# EasyEDA schematic 1-Schematic_SAE301.json
TITLE: Sheet_1; REV: 1.0; Date: 2023-10-09; Sheet: 1/1; Drawn By: og67guittet; Company: Your Company
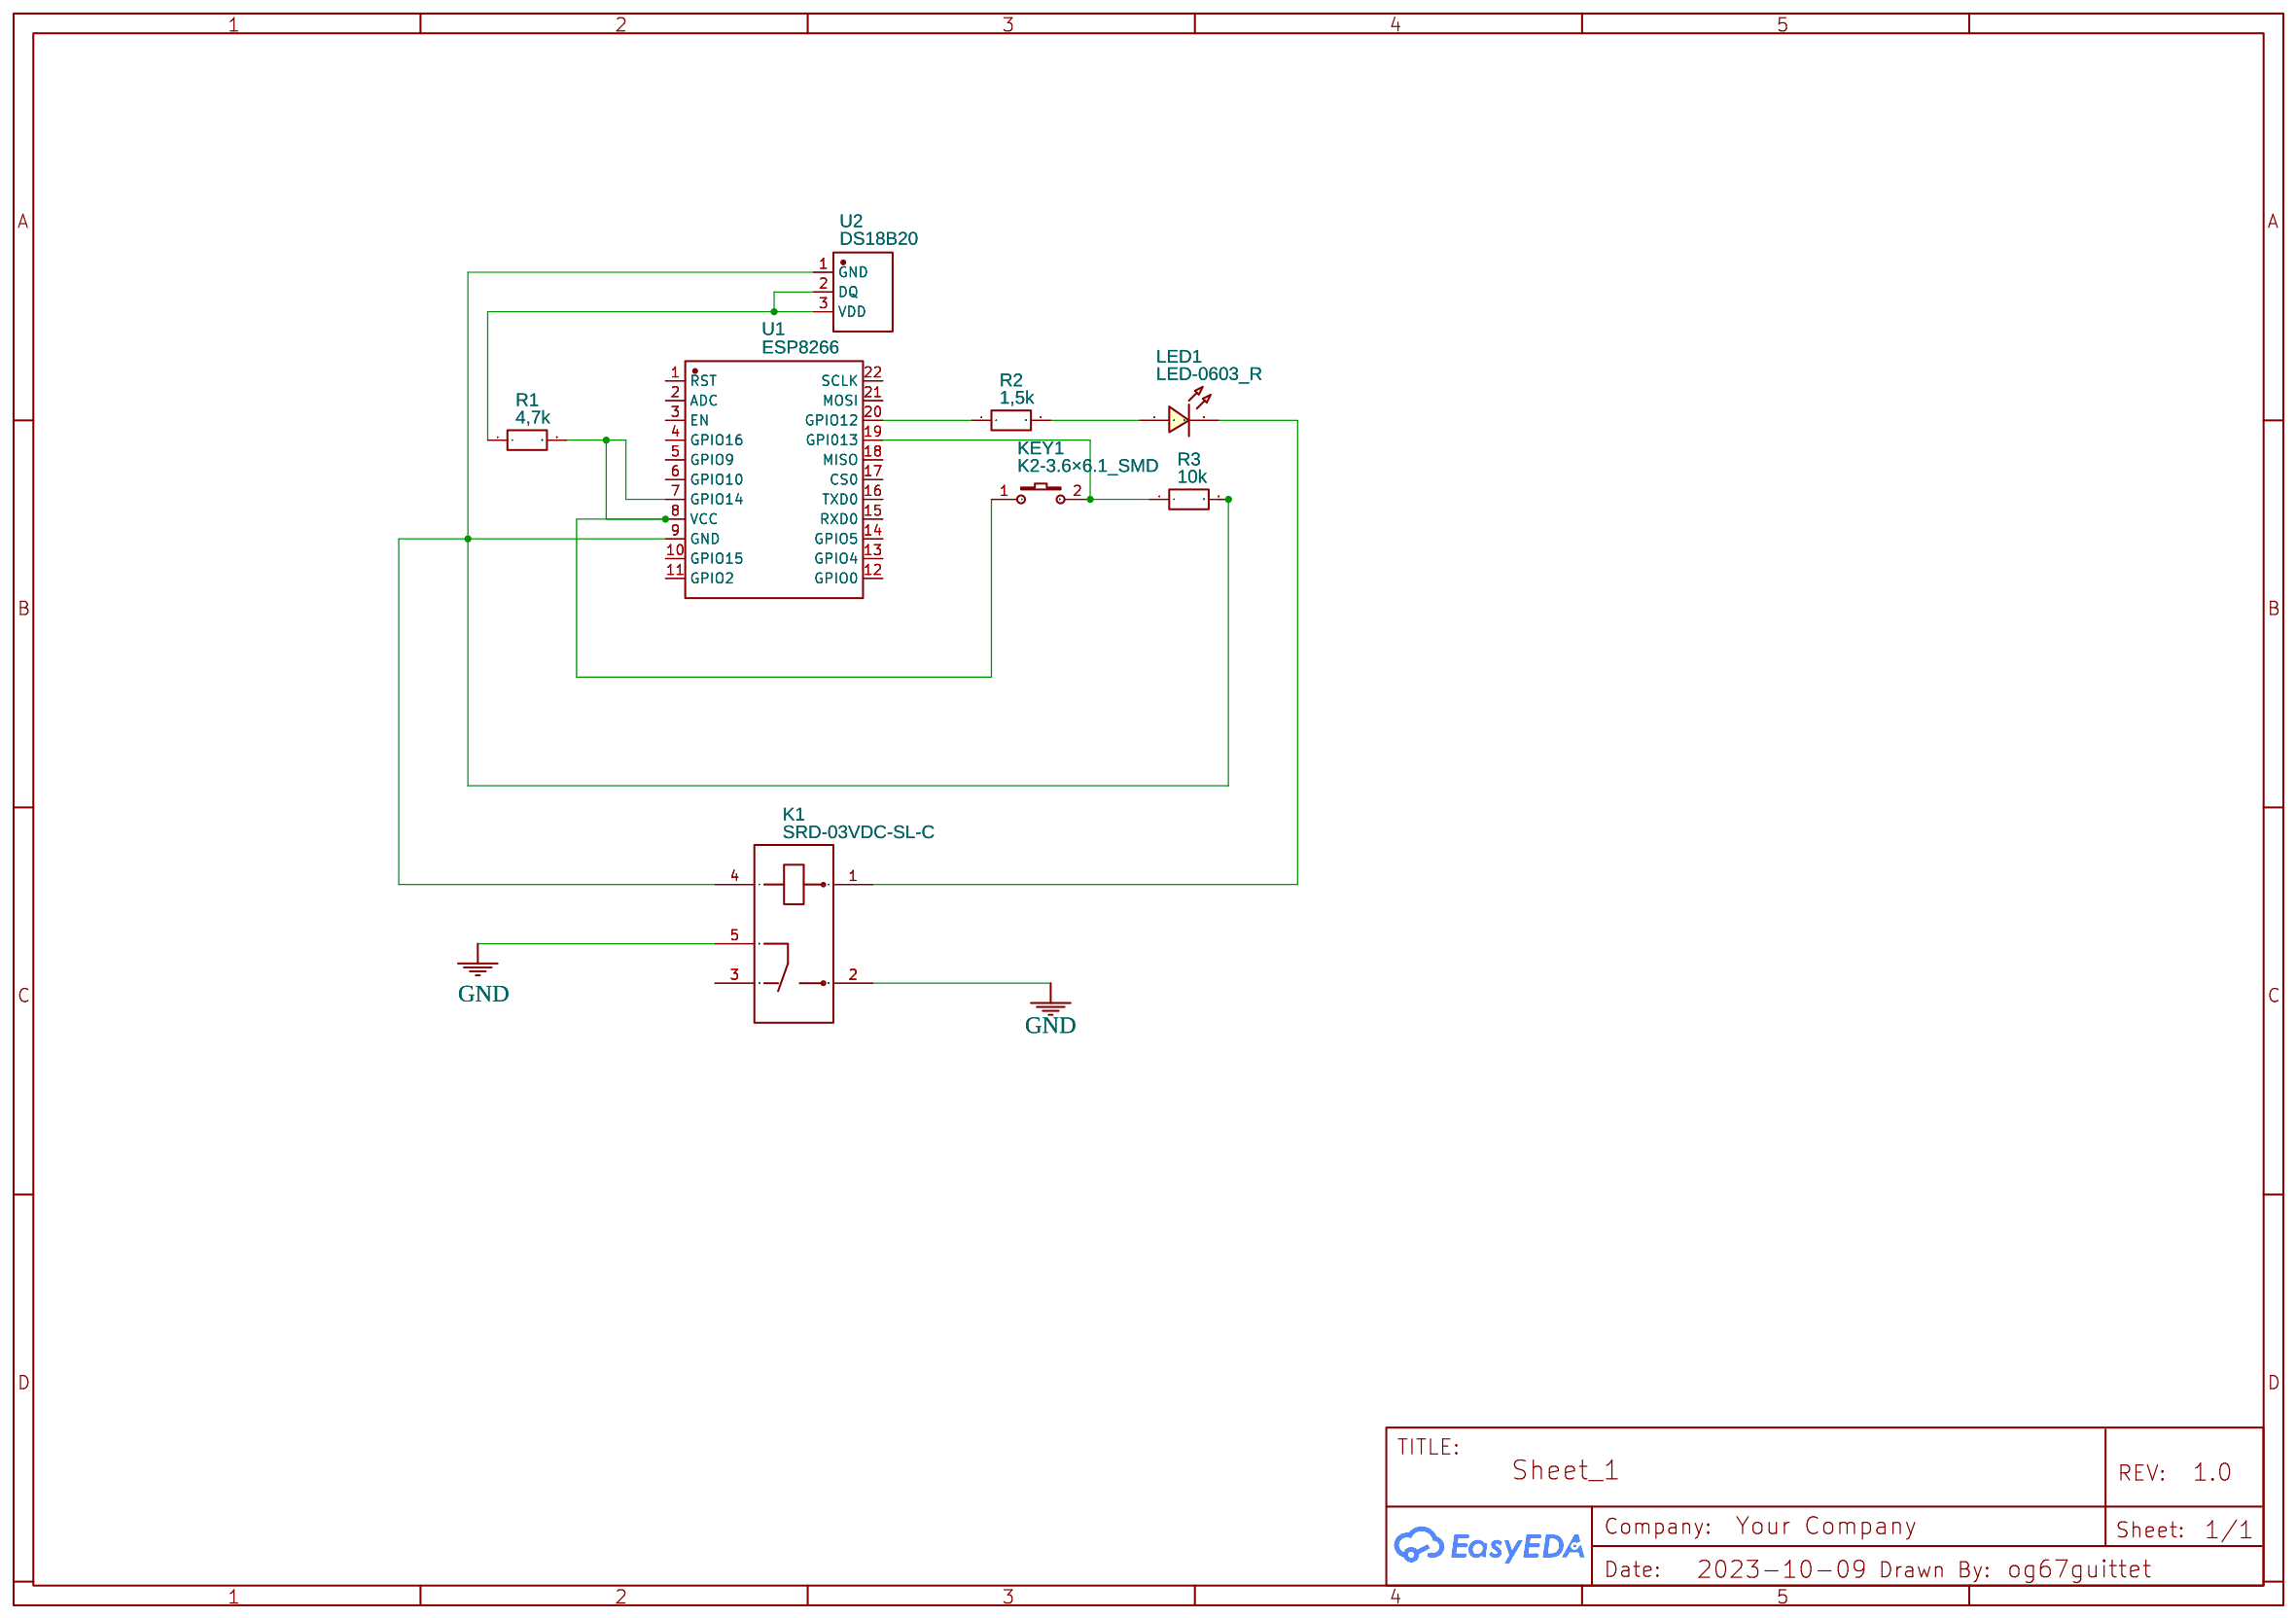
[diagram p0: schematic sheet]

## Parts
K1  SRD-03VDC-SL-C  [RELAY-TH_SRD-XXVDC-XL-C]
KEY1  K2-3.6×6.1_SMD  [KEY-SMD_2P-L6.2-W3.6-LS8.0]
LED1  LED-0603_R  [LED0603_RED]
R1  4,7k  [R0603]
R2  1,5k  [R0603]
R3  10k  [R0603]
U1  ESP8266  [WIFIM-SMD_ESP-12F-ESP8266MOD]
U2  DS18B20  [TO-92-3_L4.9-W3.7-P1.27-L]

## Library data of the parts
K1 = SRD-03VDC-SL-C: Supplier: LCSC; Manufacturer: 松乐; Supplier Part: C24585; JLCPCB Part Class: Extended Part; link: https://lcsc.com/eda_search?q=C24585&%26type=1&ref=editor
KEY1 = K2-3.6×6.1_SMD: Supplier Part: C118141; Supplier: LCSC; Manufacturer Part: K2-1107ST-A4SW-06; Contributor: LCEDA_Lib; 制造商: 韩国韩荣
LED1 = LED-0603_R: Manufacturer: EVERLIGHT(台湾亿光); Manufacturer Part: 19-217/R6C-AL1M2VY/3T; Supplier Part: C72044; Supplier: LCSC; Contributor: LCEDA_01
R1-R3 = R_0603_EU: Contributor: LCEDA_Lib
U1 = ESP8266: LINK: https://img.jlc.com/image//data/smt-stock-produce/componentSizePhoto/2021-12-02/b5eb61357b2a478295008aee8c894ebd/BG2111290693_D21112900056_font.png; Contributor: LCSC; Supplier: LCSC; Supplier Part: C9900003049; Manufacturer: null; JLCPCB Part Class: Extended Part; link: https://lcsc.com/eda_search?q=C9900003049&%26type=1&ref=editor
U2 = DS18B20: Contributor: LCSC; Supplier: LCSC; Supplier Part: C376006; Manufacturer: UMW(广东友台半导体); JLCPCB Part Class: Extended Part; link: https://lcsc.com/eda_search?q=C376006&%26type=1&ref=editor

## Nets
GND: K1.2 K1.5
Net-(K1-1): K1.1 LED1.2
Net-(K1-4): K1.4 R3.2 U1.9(GND) U2.1(GND)
Net-(KEY1-1): KEY1.1 R1.2 U1.7(GPIO14) U1.8(VCC)
Net-(KEY1-2): KEY1.2 R3.1 U1.19(GPI013)
Net-(LED1-1): LED1.1 R2.2
Net-(R1-1): R1.1 U2.2(DQ) U2.3(VDD)
Net-(R2-1): R2.1 U1.20(GPIO12)

Not connected (* = marked no-connect by the designer): K1 3; U1 1(RST) 2(ADC) 3(EN) 4(GPIO16) 5(GPIO9) 6(GPIO10) 10(GPIO15) 11(GPIO2) 12(GPIO0) 13(GPIO4) 14(GPIO5) 15(RXD0) 16(TXD0) 17(CS0) 18(MISO) 21(MOSI) 22(SCLK)
